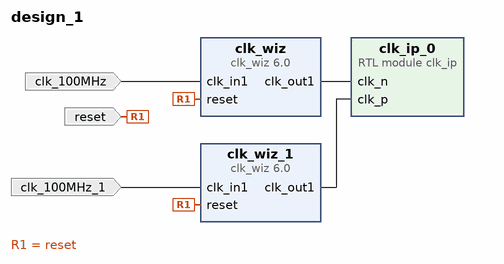
[diagram p0: block diagram of the top level]
# Vivado block design design_1, xczu7ev-ffvc1156-2-e, Vivado 2019.2
create_bd_design design_1

create_bd_port -dir I -type clk clk_100MHz
set_property -dict {CONFIG.FREQ_HZ 400000000} [get_bd_ports clk_100MHz]
create_bd_port -dir I -type rst reset
set_property -dict {CONFIG.POLARITY ACTIVE_HIGH} [get_bd_ports reset]
create_bd_port -dir I -type clk clk_100MHz_1
set_property -dict {CONFIG.FREQ_HZ 400000000} [get_bd_ports clk_100MHz_1]

create_bd_cell -type ip -vlnv xilinx.com:ip:clk_wiz:6.0 clk_wiz
set_property -dict {CONFIG.RESET_BOARD_INTERFACE reset CONFIG.USE_BOARD_FLOW true} [get_bd_cells clk_wiz]
create_bd_cell -type ip -vlnv xilinx.com:ip:clk_wiz:6.0 clk_wiz_1
set_property -dict {CONFIG.RESET_BOARD_INTERFACE reset CONFIG.USE_BOARD_FLOW true} [get_bd_cells clk_wiz_1]
create_bd_cell -type module -reference clk_ip clk_ip_0

# ---- connections ----

connect_bd_net [get_bd_pins clk_wiz/clk_out1] [get_bd_pins clk_ip_0/clk_n]
connect_bd_net [get_bd_pins clk_wiz_1/clk_out1] [get_bd_pins clk_ip_0/clk_p]
connect_bd_net [get_bd_ports clk_100MHz] [get_bd_pins clk_wiz/clk_in1]
connect_bd_net [get_bd_ports reset] [get_bd_pins clk_wiz/reset] [get_bd_pins clk_wiz_1/reset]
connect_bd_net -net clk_100MHz_1_1 [get_bd_ports clk_100MHz_1] [get_bd_pins clk_wiz_1/clk_in1]

validate_bd_design
save_bd_design
